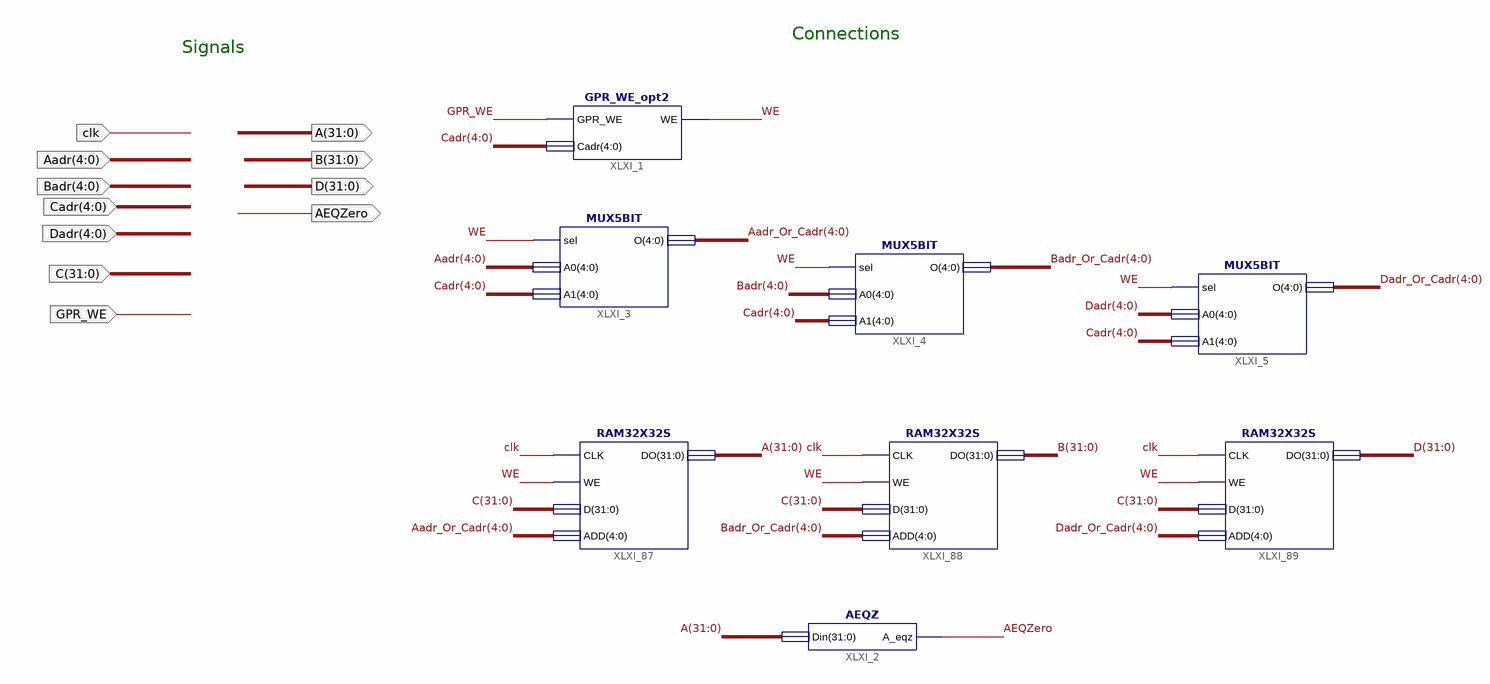
[diagram p0: schematic sheet 1]
// Xilinx ISE schematic GPR.sch (spartan6) as structural Verilog: 8 symbols, 11 ports
module GPR (
  input  clk,
  input  [31:0] C,
  input  [4:0] Dadr,
  input  [4:0] Aadr,
  input  [4:0] Badr,
  input  [4:0] Cadr,
  input  GPR_WE,
  output [31:0] A,
  output [31:0] B,
  output [31:0] D,
  output AEQZero
);

  wire WE;
  wire [4:0] Aadr_Or_Cadr, Badr_Or_Cadr, Dadr_Or_Cadr;

  MUX5BIT XLXI_3 (.sel(WE), .A0(Aadr), .A1(Cadr), .O(Aadr_Or_Cadr));
  MUX5BIT XLXI_4 (.sel(WE), .A0(Badr), .A1(Cadr), .O(Badr_Or_Cadr));
  MUX5BIT XLXI_5 (.sel(WE), .A0(Dadr), .A1(Cadr), .O(Dadr_Or_Cadr));
  AEQZ XLXI_2 (.Din(A), .A_eqz(AEQZero));
  GPR_WE_opt2 XLXI_1 (.GPR_WE(GPR_WE), .Cadr(Cadr), .WE(WE));
  RAM32X32S XLXI_87 (.ADD(Aadr_Or_Cadr), .CLK(clk), .D(C), .DO(A), .WE(WE));
  RAM32X32S XLXI_88 (.ADD(Badr_Or_Cadr), .CLK(clk), .D(C), .DO(B), .WE(WE));
  RAM32X32S XLXI_89 (.ADD(Dadr_Or_Cadr), .CLK(clk), .D(C), .DO(D), .WE(WE));

  // Notes on the sheet:
  //   Connections
  //   Signals
endmodule
